# EAGLE schematic RF-Gen_Controller (EAGLE 8.2.2)

## Sheet 1 of 4
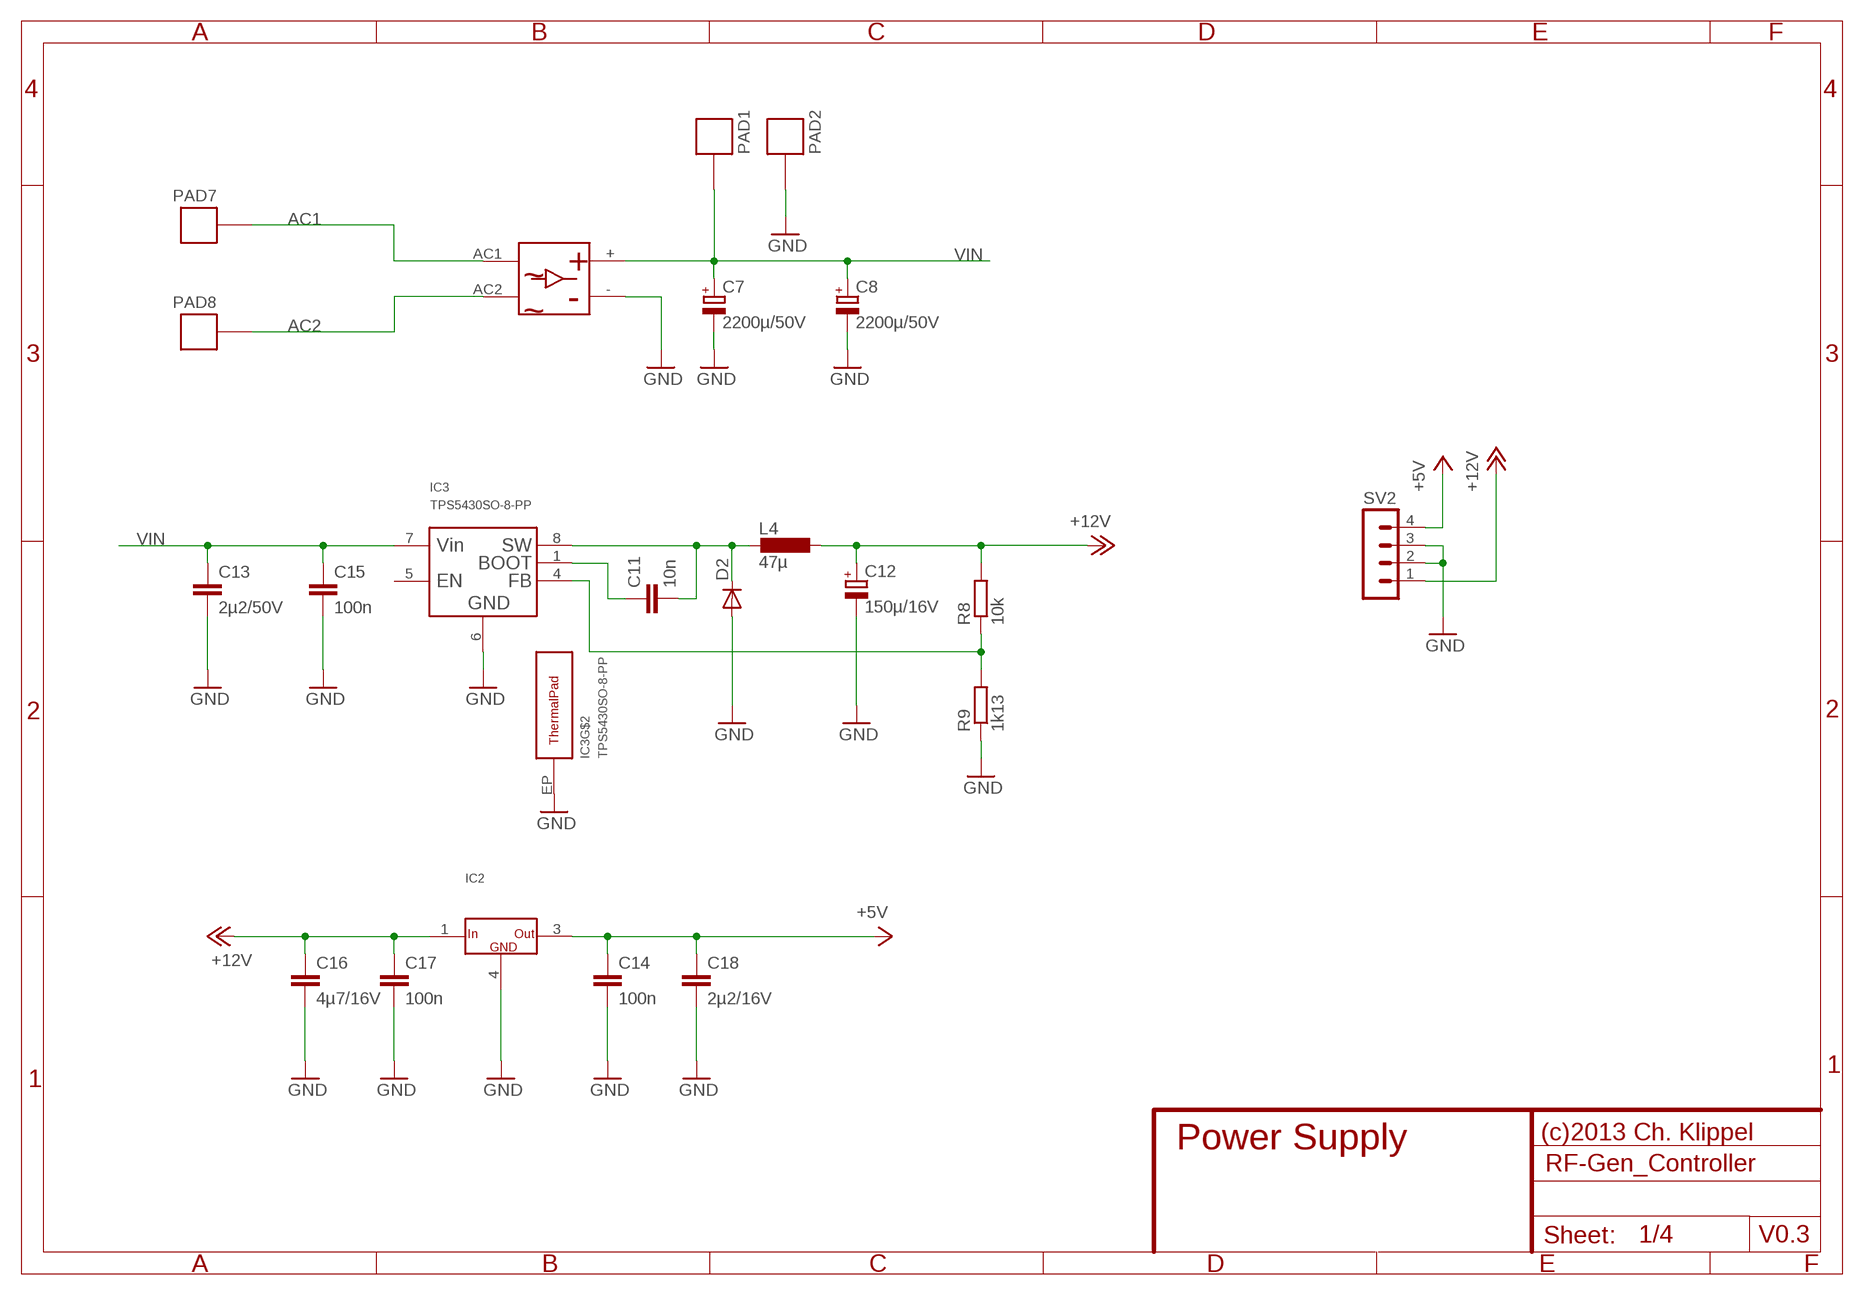
[diagram p0: schematic, sheet 1]

### Parts
BR1  RECTIFIERGBJ_THT  [GBJ_THT]
C7  2200µ/50V  C-POL-EU-EEUHD1H_VERT2  [CAP_EEUHD1H_VERT2]
C8  2200µ/50V  C-POL-EU-EEUHD1H_VERT2  [CAP_EEUHD1H_VERT2]
C11  10n  C-EU-1206  [C_1206_REFLOW]
C12  150µ/16V  C-POL-EU-AL_100_108  [CAP_AL_100_108]
C13  2µ2/50V  C-EU-1210  [C_1210_REFLOW]
C14  100n  C-EU-0805  [C_0805_REFLOW]
C15  100n  C-EU-0805  [C_0805_REFLOW]
C16  4µ7/16V  C-EU-1210  [C_1210_REFLOW]
C17  100n  C-EU-0805  [C_0805_REFLOW]
C18  2µ2/16V  C-EU-1210  [C_1210_REFLOW]
D2  DIODE-SMB  [SMB]
IC2  VREG_3DPAK-3  [DPAK-3]
IC3  TPS5430SO-8-PP  [SO-8-PP]
L4  47µ  L-EU-SSR1260  [SSR1260]
PAD1  SOLPAD5MM  [SOLPAD_5]
PAD2  SOLPAD5MM  [SOLPAD_5]
PAD7  SOLPAD5MM  [SOLPAD_5]
PAD8  SOLPAD5MM  [SOLPAD_5]
R8  10k  R-EU-0805  [R_0805_REFLOW]
R9  1k13  R-EU-0805  [R_0805_REFLOW]
SV2  MA04-1  [MA04-1]

### Nets
+5V: C14.P$1 C18.P$1 IC2.3(OUT) SV2.4 ; also sheet 2,3,4
+12V: C12.+ C16.P$1 C17.P$1 IC2.1(IN) L4.1 R8.P$2 SV2.1 ; also sheet 4
AC1: BR1.AC1 PAD7.P$1
AC2: BR1.AC2 PAD8.P$1
GND: BR1.- C7.- C8.- C12.- C13.P$2 C14.P$2 C15.P$2 C16.P$2 C17.P$2 C18.P$2 D2.A IC2.4(GND) IC3.6(GND) IC3.EP(THERMALPAD) PAD2.P$1 R9.P$1 SV2.2 SV2.3 ; also sheet 2,3,4
N$11: C11.P$1 IC3.1(BOOT)
N$13: IC3.4(FB) R8.P$1 R9.P$2
SW12: C11.P$2 D2.C IC3.8(SW) L4.2
VIN: BR1.+ C7.+ C8.+ C13.P$1 C15.P$1 IC3.7(VIN) PAD1.P$1 ; also sheet 4
Unconnected: IC3.5(EN)

### Notes on the sheet
- (c)2013 Ch. Klippel
- Power Supply
- V0.3

## Sheet 2 of 4
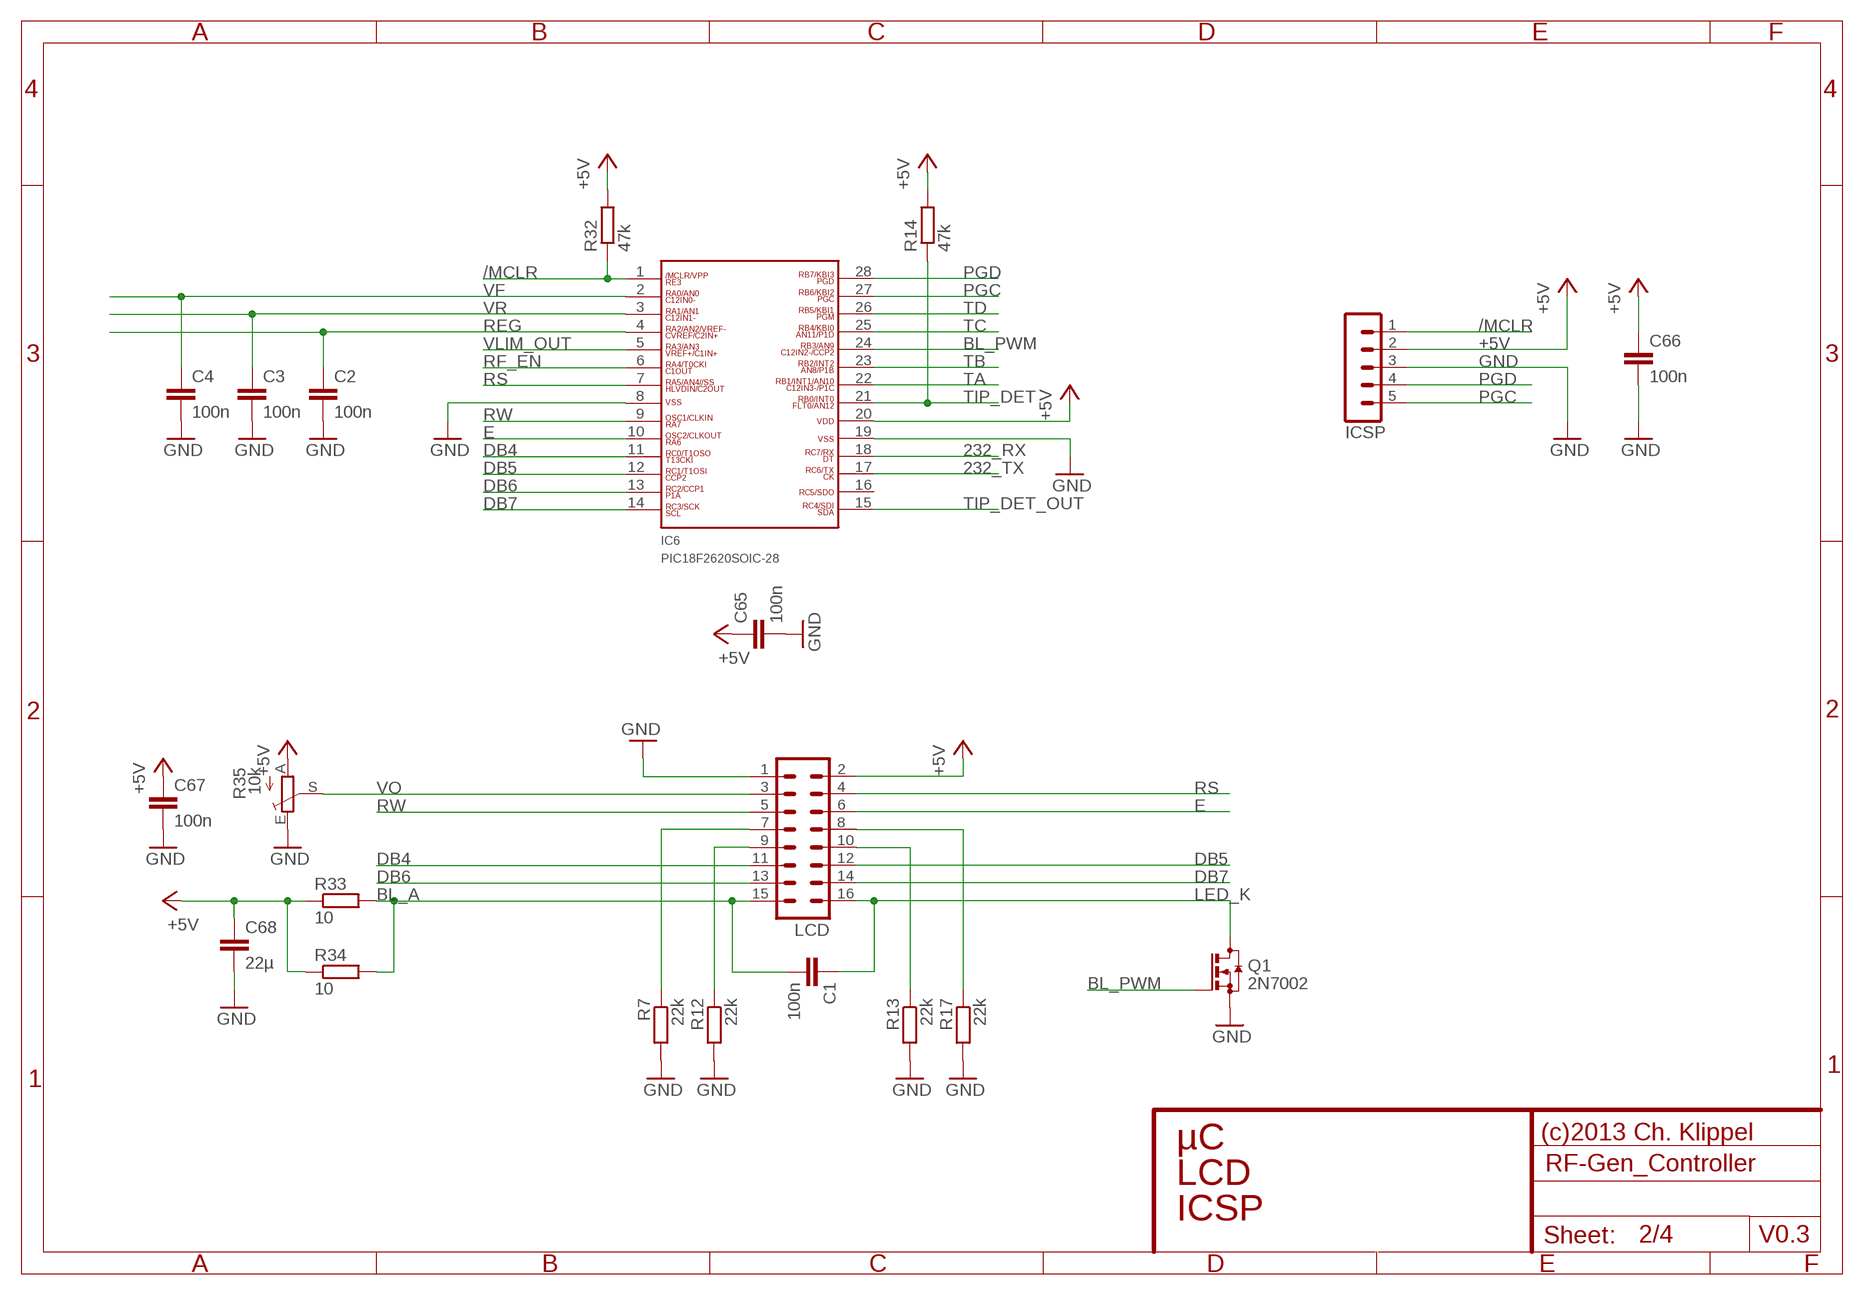
[diagram p1: schematic, sheet 2]

### Parts
C1  100n  C-EU-0805  [C_0805_REFLOW]
C2  100n  C-EU-0805  [C_0805_REFLOW]
C3  100n  C-EU-0805  [C_0805_REFLOW]
C4  100n  C-EU-0805  [C_0805_REFLOW]
C65  100n  C-EU-0805  [C_0805_REFLOW]
C66  100n  C-EU-0805  [C_0805_REFLOW]
C67  100n  C-EU-0805  [C_0805_REFLOW]
C68  22µ  C-EU-1206  [C_1206_REFLOW]
IC6  PIC18F2620SOIC-28  PIC18F26K20SOIC-28  [SOIC-28]
ICSP  MA05-1THT  [MA05-1]
LCD  ML16  [ML16]
Q1  2N7002  BSS123  [SOT23]
R7  22k  R-EU-0805  [R_0805_REFLOW]
R12  22k  R-EU-0805  [R_0805_REFLOW]
R13  22k  R-EU-0805  [R_0805_REFLOW]
R14  47k  R-EU-0805  [R_0805_REFLOW]
R17  22k  R-EU-0805  [R_0805_REFLOW]
R32  47k  R-EU-0805  [R_0805_REFLOW]
R33  10  R-EU-1206  [R_1206_REFLOW]
R34  10  R-EU-1206  [R_1206_REFLOW]
R35  10k  TRIM_EU-3364W  [3364W]

### Nets
232_RX: IC6.18 ; also sheet 3
232_TX: IC6.17 ; also sheet 3
+5V: C65.P$1 C66.P$1 C67.P$1 C68.P$1 IC6.20 ICSP.2 LCD.2 R14.P$2 R32.P$2 R33.P$1 R34.P$1 R35.A ; also sheet 1,3,4
/MCLR: IC6.1 ICSP.1 R32.P$1 ; also sheet 3
BL_A: C1.P$2 LCD.15 R33.P$2 R34.P$2
BL_PWM: IC6.24 Q1.1(G)
DB4: IC6.11 LCD.11
DB5: IC6.12 LCD.12
DB6: IC6.13 LCD.13
DB7: IC6.14 LCD.14
E: IC6.10 LCD.6
GND: C2.P$2 C3.P$2 C4.P$2 C65.P$2 C66.P$2 C67.P$2 C68.P$2 IC6.8 IC6.19 ICSP.3 LCD.1 Q1.2(S) R7.P$2 R12.P$2 R13.P$2 R17.P$2 R35.E ; also sheet 1,3,4
LED_K: C1.P$1 LCD.16 Q1.3(D)
N$3: LCD.9 R12.P$1
N$4: LCD.7 R7.P$1
N$5: LCD.10 R13.P$1
N$16: LCD.8 R17.P$1
PGC: IC6.27 ICSP.5
PGD: IC6.28 ICSP.4
REG: C2.P$1 IC6.4 ; also sheet 4
RF_EN: IC6.6 ; also sheet 4
RS: IC6.7 LCD.4
RW: IC6.9 LCD.5
TA: IC6.22 ; also sheet 3
TB: IC6.23 ; also sheet 3
TC: IC6.25 ; also sheet 3
TD: IC6.26 ; also sheet 3
TIP_DET: IC6.21 R14.P$1 ; also sheet 4
TIP_DET_OUT: IC6.15
VF: C4.P$1 IC6.2 ; also sheet 4
VLIM_OUT: IC6.5 ; also sheet 4
VO: LCD.3 R35.S
VR: C3.P$1 IC6.3 ; also sheet 4
Unconnected: IC6.16

### Notes on the sheet
- (c)2013 Ch. Klippel
- µC
- LCD
- ICSP
- V0.3

## Sheet 3 of 4
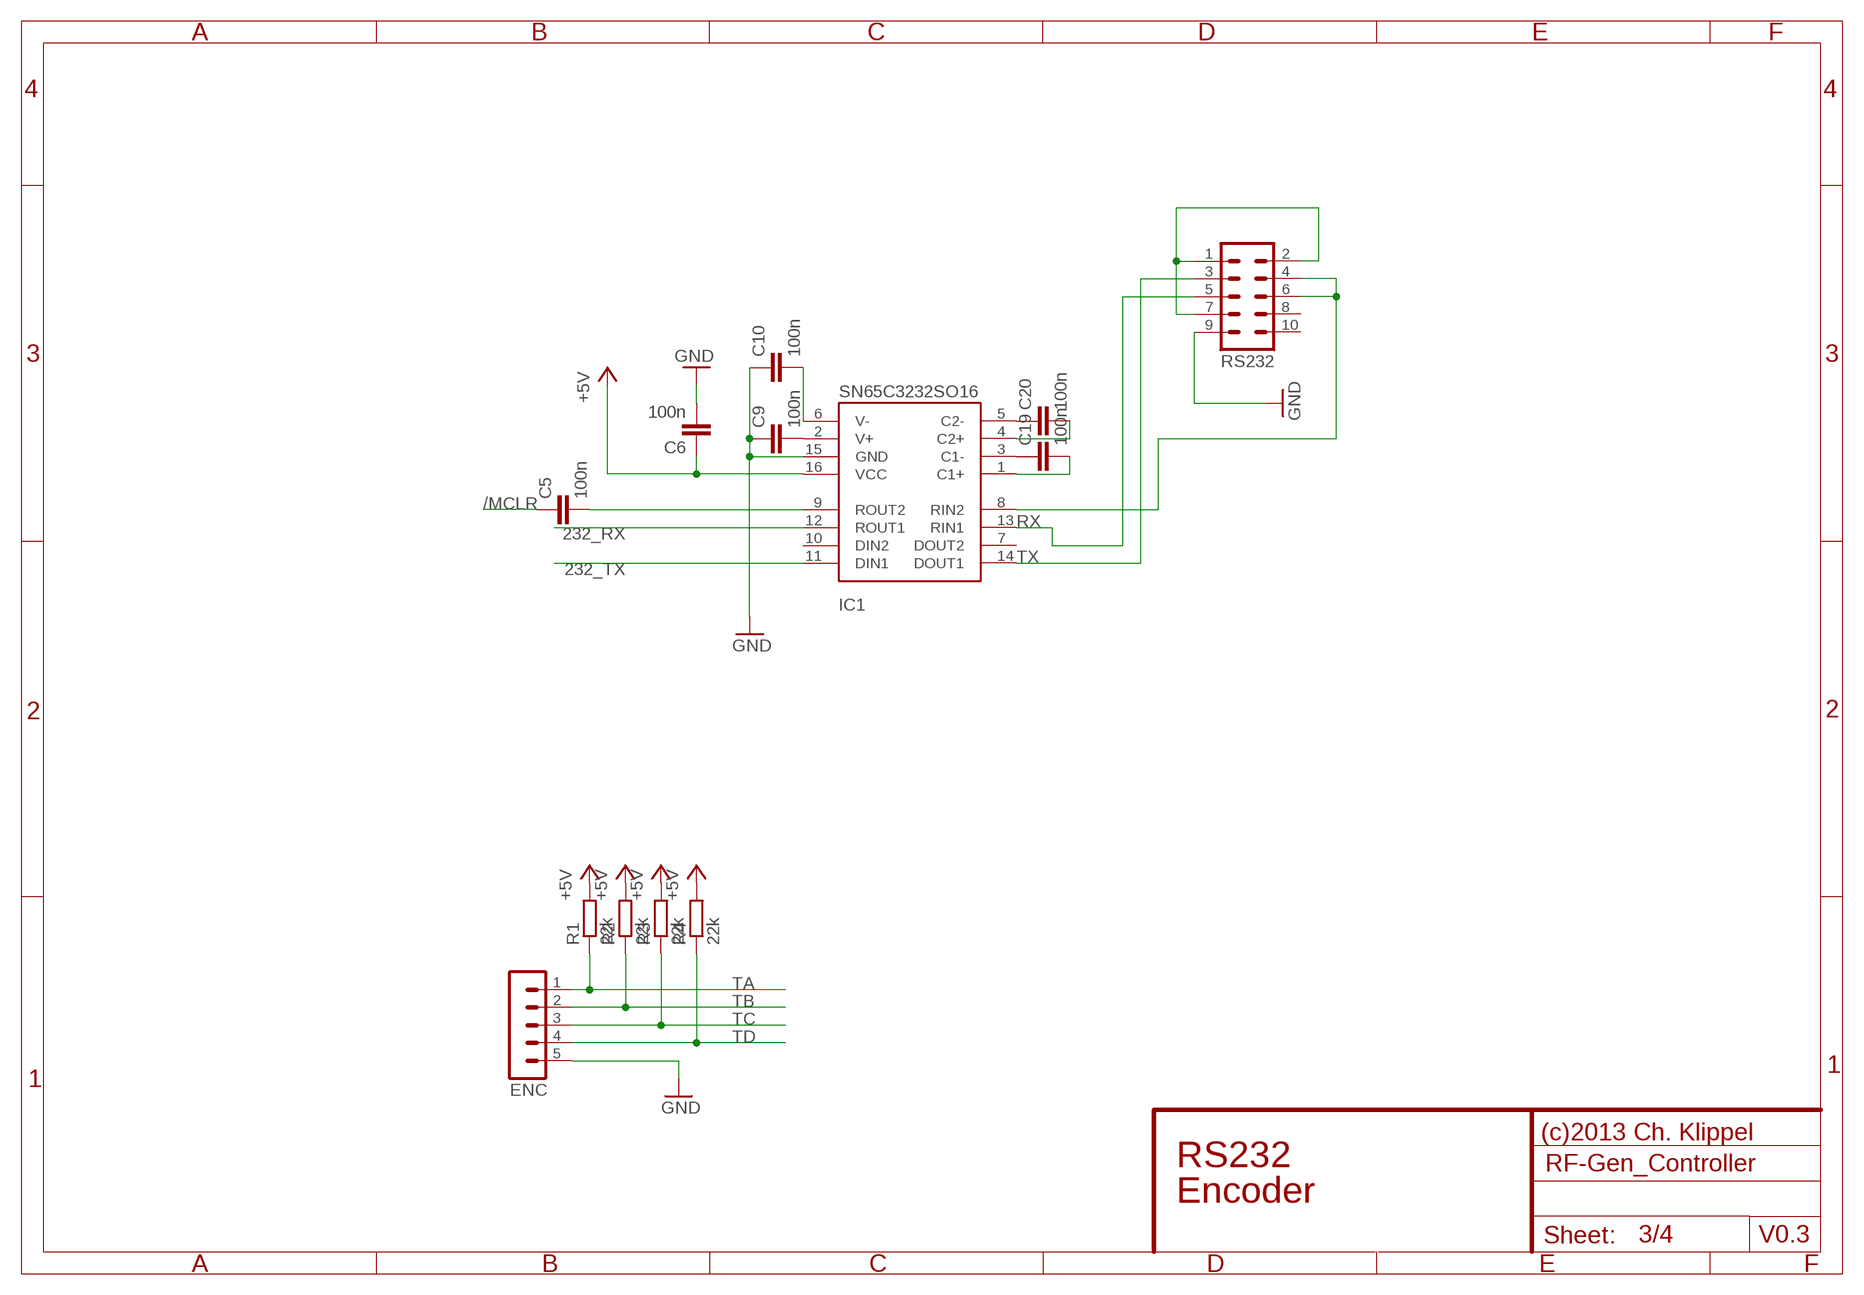
[diagram p2: schematic, sheet 3]

### Parts
C5  100n  C-EU-0805  [C_0805_REFLOW]
C6  100n  C-EU-0805  [C_0805_REFLOW]
C9  100n  C-EU-0805  [C_0805_REFLOW]
C10  100n  C-EU-0805  [C_0805_REFLOW]
C19  100n  C-EU-0805  [C_0805_REFLOW]
C20  100n  C-EU-0805  [C_0805_REFLOW]
ENC  MA05-1THT  [MA05-1]
IC1  SN65C3232SO16  [SO16]
R1  22k  R-EU-0805  [R_0805_REFLOW]
R2  22k  R-EU-0805  [R_0805_REFLOW]
R3  22k  R-EU-0805  [R_0805_REFLOW]
R4  22k  R-EU-0805  [R_0805_REFLOW]
RS232  ML10  [ML10]

### Nets
232_RX: IC1.12(ROUT1) ; also sheet 2
232_TX: IC1.11(DIN1) ; also sheet 2
+5V: C6.P$1 IC1.16(VCC) R1.P$2 R2.P$2 R3.P$2 R4.P$2 ; also sheet 1,2,4
/MCLR: C5.P$1 ; also sheet 2
DETECT: RS232.1 RS232.2 RS232.7
GND: C6.P$2 C9.P$1 C10.P$1 ENC.5 IC1.15(GND) RS232.9 ; also sheet 1,2,4
N$6: C9.P$2 IC1.2(V+)
N$8: C5.P$2 IC1.9(ROUT2)
N$9: C10.P$2 IC1.6(V-)
N$14: C19.P$1 IC1.3(C1-)
N$15: C20.P$1 IC1.5(C2-)
N$20: C20.P$2 IC1.4(C2+)
N$21: C19.P$2 IC1.1(C1+)
RX: IC1.13(RIN1) RS232.5
SRESET: IC1.8(RIN2) RS232.4 RS232.6
TA: ENC.1 R1.P$1 ; also sheet 2
TB: ENC.2 R2.P$1 ; also sheet 2
TC: ENC.3 R3.P$1 ; also sheet 2
TD: ENC.4 R4.P$1 ; also sheet 2
TX: IC1.14(DOUT1) RS232.3
Unconnected: IC1.7(DOUT2) IC1.10(DIN2) RS232.8 RS232.10

### Notes on the sheet
- (c)2013 Ch. Klippel
- RS232
- Encoder
- V0.3

## Sheet 4 of 4
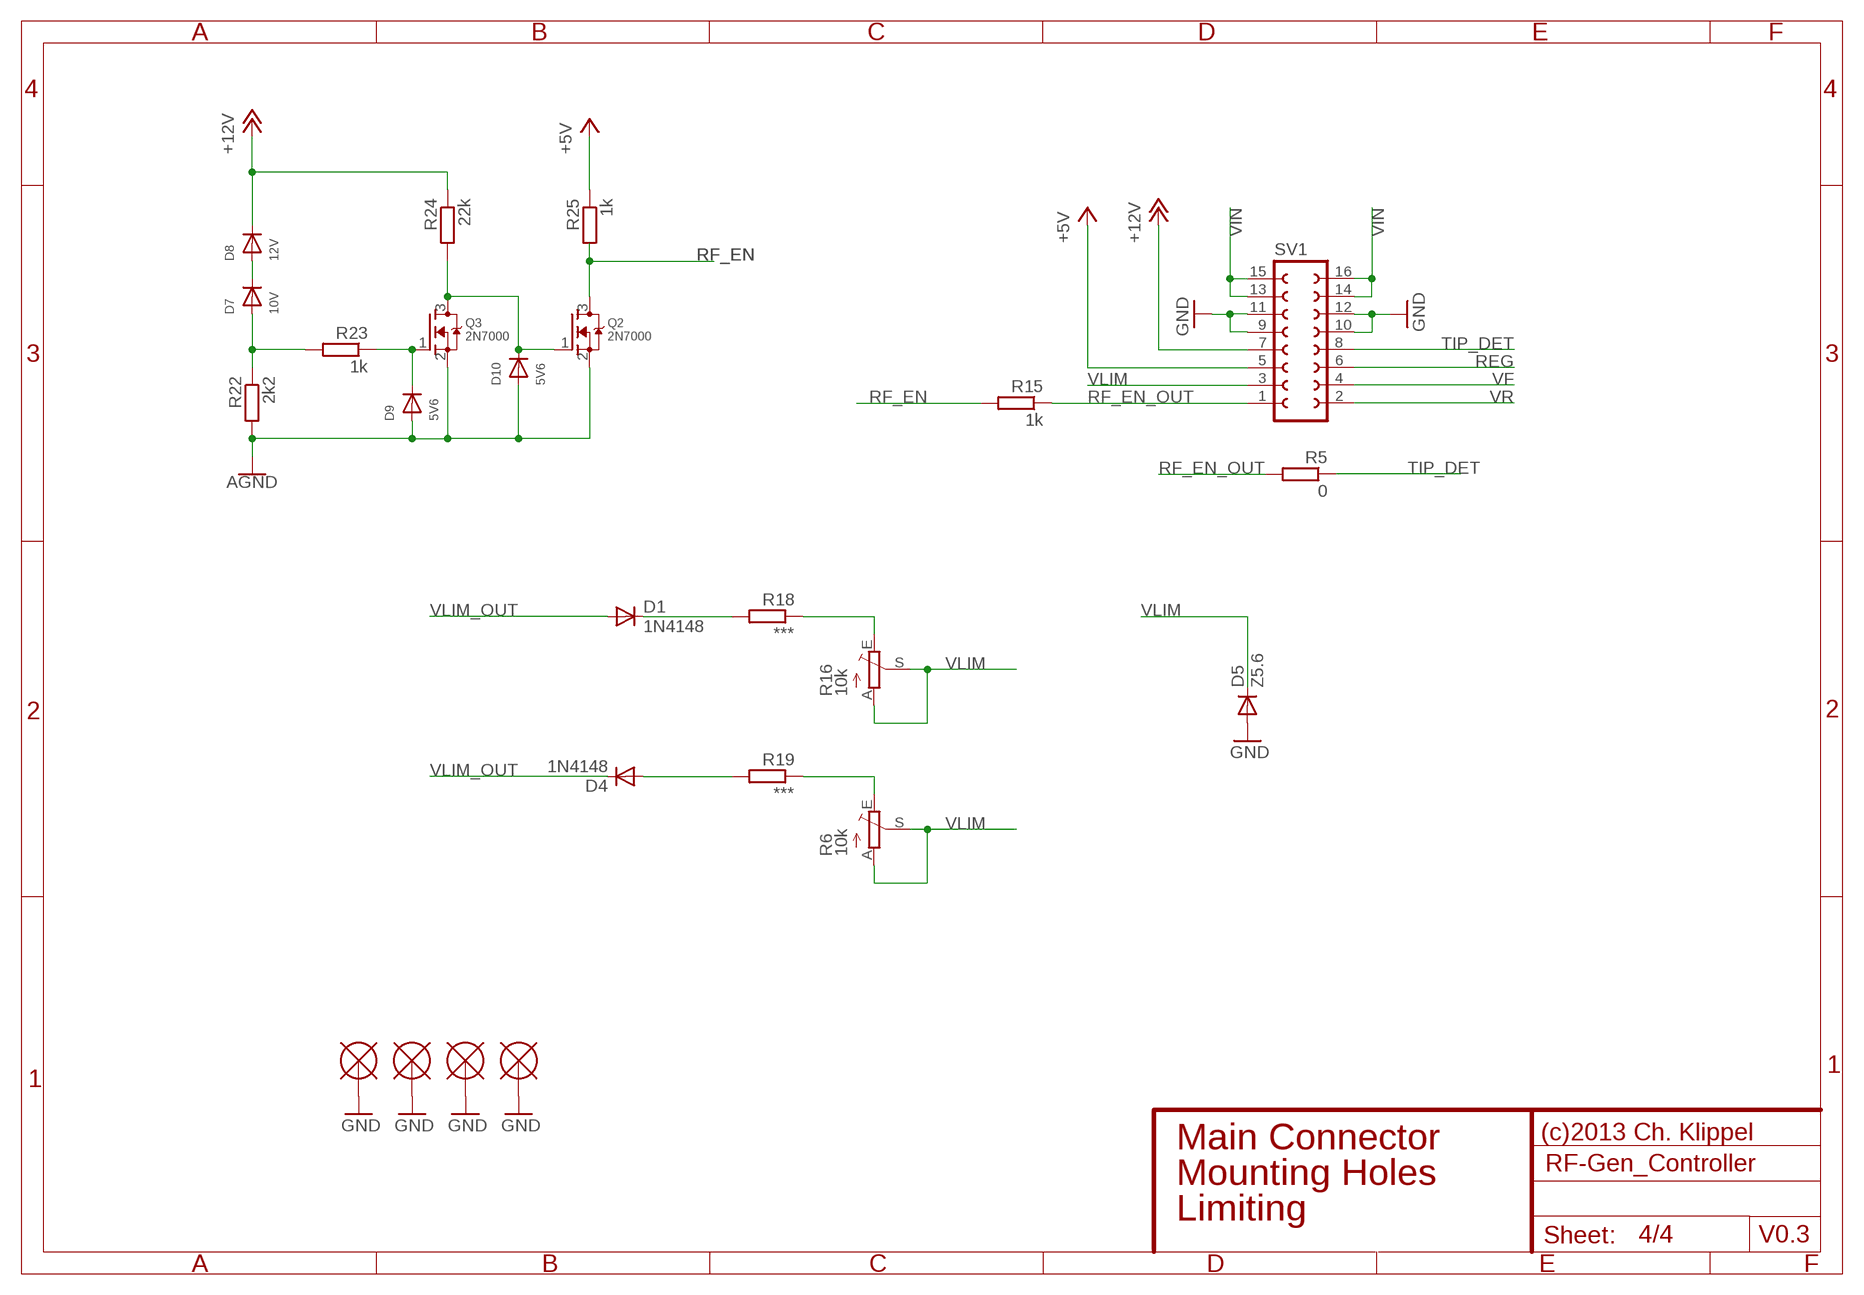
[diagram p3: schematic, sheet 4]

### Parts
D1  1N4148  DIODE-LL-34  [LL-34]
D4  1N4148  DIODE-LL-34  [LL-34]
D5  Z5.6  DIODE-LL-34  [LL-34]
D7  10V  DIODESOD-323F  [SOD-323F]
D8  12V  DIODESOD-323F  [SOD-323F]
D9  5V6  DIODESOD-323F  [SOD-323F]
D10  5V6  DIODESOD-323F  [SOD-323F]
Q2  2N7000  MOSFET-NREFLOW  [SOT23]
Q3  2N7000  MOSFET-NREFLOW  [SOT23]
R5  0  R-EU-0805  [R_0805_REFLOW]
R6  10k  TRIM_EU-3364W  [3364W]
R15  1k  R-EU-0805  [R_0805_REFLOW]
R16  10k  TRIM_EU-3364W  [3364W]
R18  ***  R-EU-0805  [R_0805_REFLOW]
R19  ***  R-EU-0805  [R_0805_REFLOW]
R22  2k2  R-EU-0805  [R_0805_REFLOW]
R23  1k  R-EU-0805  [R_0805_REFLOW]
R24  22k  R-EU-0805  [R_0805_REFLOW]
R25  1k  R-EU-0805  [R_0805_REFLOW]
SV1  FE08-2  [FE08-2]
U$6  MOUNTPADM3_WASHER  [PAD_M3_WASHER]
U$7  MOUNTPADM3_WASHER  [PAD_M3_WASHER]
U$8  MOUNTPADM3_WASHER  [PAD_M3_WASHER]
U$9  MOUNTPADM3_WASHER  [PAD_M3_WASHER]

### Nets
+5V: R25.P$1 SV1.5 ; also sheet 1,2,3
+12V: D8.C R24.P$1 SV1.7 ; also sheet 1
GND: D5.A SV1.9 SV1.10 SV1.11 SV1.12 U$6.P$1 U$7.P$1 U$8.P$1 U$9.P$1 ; also sheet 1,2,3
N$1: R6.E R19.P$1
N$2: R16.E R18.P$1
N$7: D9.A D10.A Q2.2(S) Q3.2(S) R22.P$2 ; supply symbol labelled AGND
N$10: D10.C Q2.1(G) Q3.3(D) R24.P$2
N$17: D1.C R18.P$2
N$18: D9.C Q3.1(G) R23.P$1
N$19: D4.A R19.P$2
N$22: D7.A R22.P$1 R23.P$2
N$25: D7.C D8.A
REG: SV1.6 ; also sheet 2
RF_EN: Q2.3(D) R15.P$2 R25.P$2 ; also sheet 2
RF_EN_OUT: R5.P$2 R15.P$1 SV1.1
TIP_DET: R5.P$1 SV1.8 ; also sheet 2
VF: SV1.4 ; also sheet 2
VIN: SV1.13 SV1.14 SV1.15 SV1.16 ; also sheet 1
VLIM: D5.C R6.A R6.S R16.A R16.S SV1.3
VLIM_OUT: D1.A D4.C ; also sheet 2
VR: SV1.2 ; also sheet 2

### Notes on the sheet
- (c)2013 Ch. Klippel
- Main Connector
- Mounting Holes
- Limiting
- V0.3

## Library data of the parts
BR1 = parts:RECTIFIER
C1-C6 C9-C11 C13-C20 C65-C68 = parts:C-EU-
C7 C8 C12 = parts:C-POL-EU-
D1 D2 D4 D5 = parts:DIODE-: RECTIFIER DIODES
D7-D10 = adafruit:DIODE: Diode SMADIODE - SMA Surface Mount Package 20V 1A Schottky Diode Digikey: 641-1014-6-ND DO-1N4148 - Through Hole Small Current Diode SOD-123 20V 1 A (.5mV Vf) Schottky Diode - Digikey: MBRX120TPMSCT-ND SOD-323 10V 570mA (.38mV Vf, 3ns) Schottky Diode - Digikey: ZLLS410CT-ND SOD-523 30V 30mA Schottky Diode (RB751S-40TE61) - Digikey: RB751S-40TE61CT-ND SOT23-R/W - SOT23 Package (R = Solder Paste/Reflow Ovens, W = Hand-Soldering) BAT54Film 40V 300mA - Digikey: 497-7162-1-ND
ENC ICSP = parts:MA05-1: PIN HEADER
IC1 = bauteile:SN65C3232
IC2 = parts:VREG_3
IC3 = parts:TPS5430
IC6 = parts:PIC18F26K20
L4 = parts:L-EU-
LCD = con-harting-ml:ML16: HARTING
PAD1 PAD2 PAD7 PAD8 = parts:SOLPAD
Q1 = parts:BSS123: N-CHANNEL MOS FET
Q2 Q3 = adafruit:MOSFET-N: N-Channel Mosfet 2N7002E - 60V 260mA SOT23 [Digikey: 2N7002ET1GOSTR-ND] - REEL BSH103 - 30V 850mA SOT23 [Digikey: 568-5013-1-ND]
R1-R5 R7-R9 R12-R15 R17-R19 R22-R25 R32-R34 = parts:R-EU-
R6 R16 R35 = parts:TRIM_EU-: POTENTIOMETER
RS232 = con-harting-ml:ML10: HARTING
SV1 = con-lsta:FE08-2: FEMALE HEADER
SV2 = con-lstb:MA04-1: PIN HEADER
U$6-U$9 = parts:MOUNTPAD